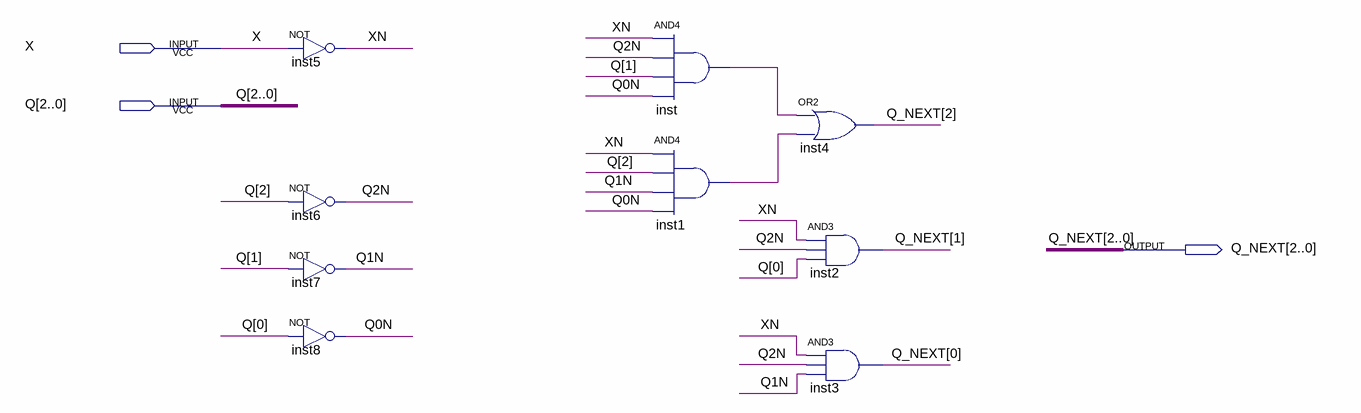
[diagram p0: schematic sheet]
// Quartus schematic NEXT_STATE.bdf as structural Verilog: 9 symbols, 3 pins
module NEXT_STATE (
  input  X,
  input  [2:0] Q,
  output [2:0] Q_NEXT
);

  wire inst1_out, inst_out, Q0N, Q1N, Q2N, XN;

  not inst5 (XN, X);
  not inst6 (Q2N, Q[2]);
  not inst7 (Q1N, Q[1]);
  not inst8 (Q0N, Q[0]);
  and inst (inst_out, XN, Q2N, Q[1], Q0N);
  and inst1 (inst1_out, XN, Q[2], Q1N, Q0N);
  or inst4 (Q_NEXT[2], inst_out, inst1_out);
  and inst2 (Q_NEXT[1], XN, Q2N, Q[0]);
  and inst3 (Q_NEXT[0], XN, Q2N, Q1N);
endmodule
